# Altium project CNFET_PCB.PrjPcb (part 2 of 2)
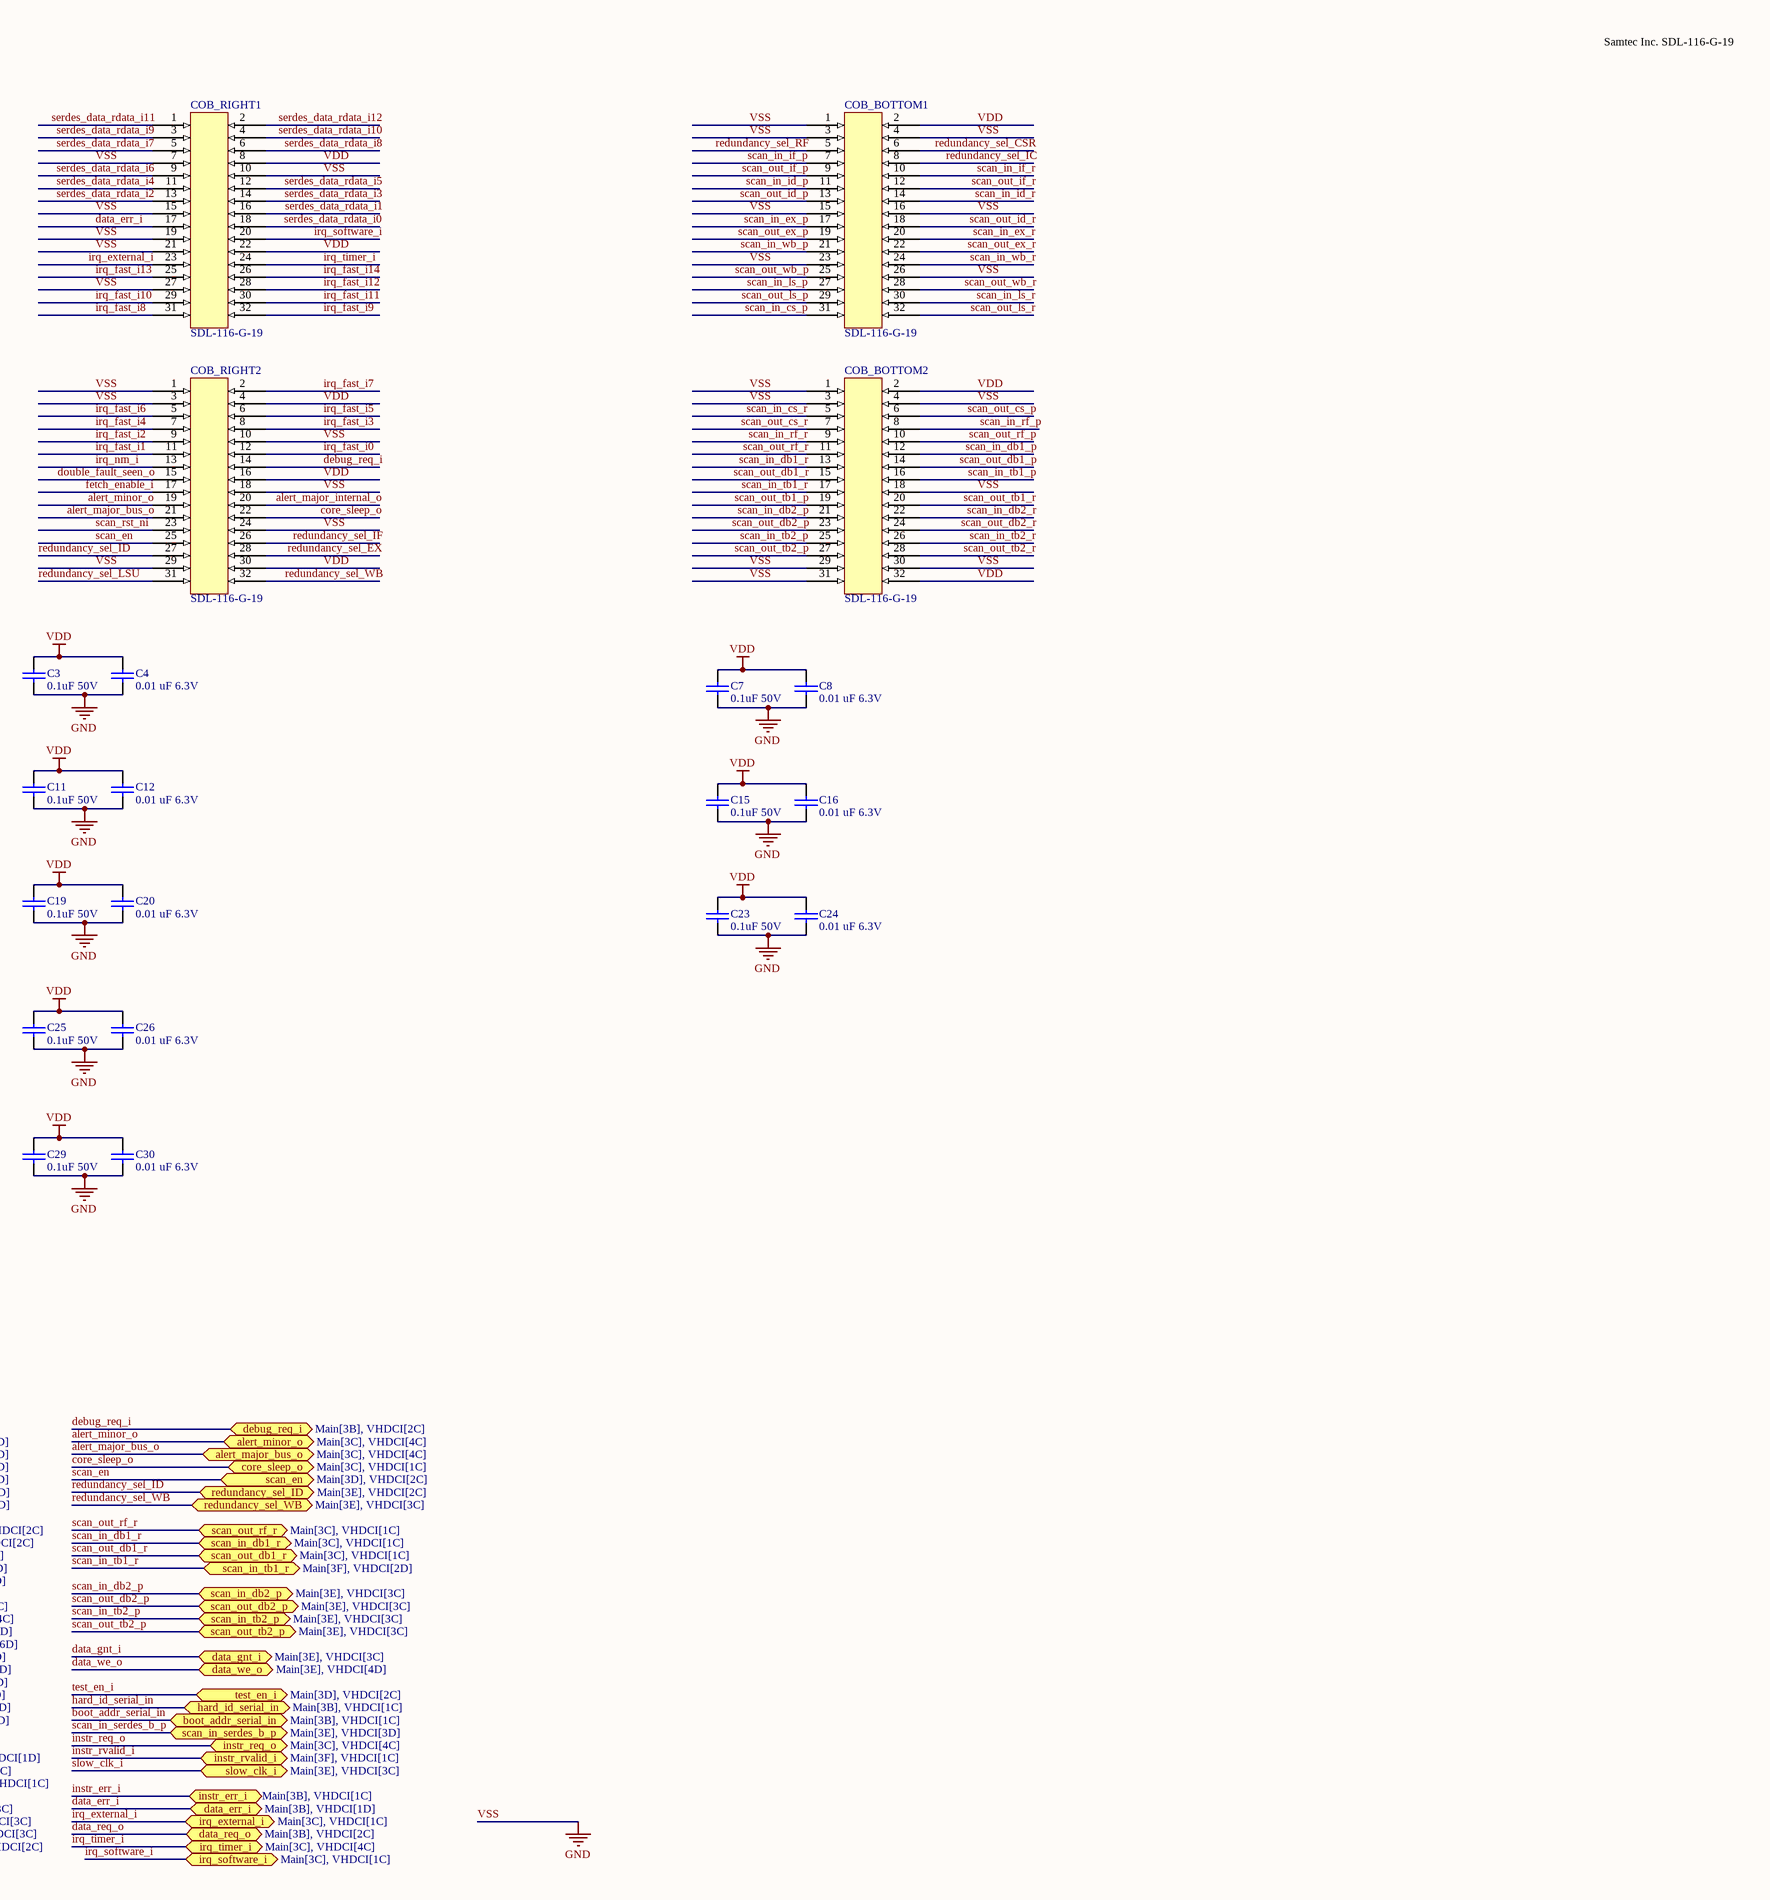
[diagram p5: COBConnector.SchDoc, right]

## Nets that join several sheets
VDD: VHDCI (J6.51), COBConnector (45 pins)
VSS: VHDCI (192 pins), COBConnector (81 pins)
alert_major_bus_o: VHDCI (J4.29), COBConnector (COB_RIGHT2.21)
alert_major_internal_o: VHDCI (J4.27), COBConnector (COB_RIGHT2.20)
alert_minor_o: VHDCI (J4.25), COBConnector (COB_RIGHT2.19)
boot_addr_serial_in: VHDCI (J6.27), COBConnector (COB_LEFT2.26)
boot_addr_shift_en: VHDCI (J6.25), COBConnector (COB_LEFT2.27)
core_sleep_o: VHDCI (J4.31), COBConnector (COB_RIGHT2.22)
data_err_i: VHDCI (J3.57), COBConnector (COB_RIGHT1.17)
data_gnt_i: VHDCI (J3.45), COBConnector (COB_TOP2.27)
data_req_o: VHDCI (J3.47), COBConnector (COB_TOP2.28)
data_rvalid_i: VHDCI (J3.43), COBConnector (COB_TOP2.26)
data_wdata_integ_o0: VHDCI (J3.7), COBConnector (COB_TOP1.8)
data_wdata_integ_o1: VHDCI (J3.5), COBConnector (COB_TOP1.7)
data_wdata_integ_o2: VHDCI (J3.3), COBConnector (COB_TOP1.10)
data_wdata_integ_o3: VHDCI (J3.1), COBConnector (COB_TOP1.9)
data_wdata_integ_o4: VHDCI (J3.35), COBConnector (COB_TOP1.12)
data_wdata_integ_o5: VHDCI (J3.37), COBConnector (COB_TOP1.11)
data_wdata_integ_o6: VHDCI (J3.39), COBConnector (COB_TOP1.16)
data_we_o: VHDCI (J3.41), COBConnector (COB_TOP2.25)
debug_req_i: VHDCI (J4.19), COBConnector (COB_RIGHT2.14)
double_fault_seen_o: VHDCI (J4.21), COBConnector (COB_RIGHT2.15)
fast_clk_i: VHDCI (J6.55), COBConnector (COB_LEFT2.2)
fetch_enable_i: VHDCI (J4.23), COBConnector (COB_RIGHT2.17)
hard_id_serial_in: VHDCI (J6.23), COBConnector (COB_LEFT2.28)
hard_id_shift_en: VHDCI (J6.21), COBConnector (COB_LEFT2.29)
instr_err_i: VHDCI (J3.49), COBConnector (COB_LEFT1.1)
instr_gnt_i: VHDCI (J6.59), COBConnector (COB_LEFT2.17)
instr_req_o: VHDCI (J6.61), COBConnector (COB_LEFT2.18)
instr_rvalid_i: VHDCI (J6.57), COBConnector (COB_LEFT2.16)
irq_external_i: VHDCI (J4.49), COBConnector (COB_RIGHT1.23)
irq_fast_i0: VHDCI (J4.15), COBConnector (COB_RIGHT2.12)
irq_fast_i1: VHDCI (J4.13), COBConnector (COB_RIGHT2.11)
irq_fast_i2: VHDCI (J4.11), COBConnector (COB_RIGHT2.9)
irq_fast_i3: VHDCI (J4.9), COBConnector (COB_RIGHT2.8)
irq_fast_i4: VHDCI (J4.7), COBConnector (COB_RIGHT2.7)
irq_fast_i5: VHDCI (J4.5), COBConnector (COB_RIGHT2.6)
irq_fast_i6: VHDCI (J4.3), COBConnector (COB_RIGHT2.5)
irq_fast_i7: VHDCI (J4.1), COBConnector (COB_RIGHT2.2)
irq_fast_i8: VHDCI (J4.35), COBConnector (COB_RIGHT1.31)
irq_fast_i9: VHDCI (J4.37), COBConnector (COB_RIGHT1.32)
irq_fast_i10: VHDCI (J4.39), COBConnector (COB_RIGHT1.29)
irq_fast_i11: VHDCI (J4.41), COBConnector (COB_RIGHT1.30)
irq_fast_i12: VHDCI (J4.43), COBConnector (COB_RIGHT1.28)
irq_fast_i13: VHDCI (J4.45), COBConnector (COB_RIGHT1.25)
irq_fast_i14: VHDCI (J4.47), COBConnector (COB_RIGHT1.26)
irq_nm_i: VHDCI (J4.17), COBConnector (COB_RIGHT2.13)
irq_software_i: VHDCI (J3.55), COBConnector (COB_RIGHT1.20)
irq_timer_i: VHDCI (J3.53), COBConnector (COB_RIGHT1.24)
redundancy_sel_CSR: VHDCI (J4.51), COBConnector (COB_BOTTOM1.6)
redundancy_sel_EX: VHDCI (J4.57), COBConnector (COB_RIGHT2.28)
redundancy_sel_IC: VHDCI (J5.47), COBConnector (COB_BOTTOM1.8)
redundancy_sel_ID: VHDCI (J4.59), COBConnector (COB_RIGHT2.27)
redundancy_sel_IF: VHDCI (J4.61), COBConnector (COB_RIGHT2.26)
redundancy_sel_LSU: VHDCI (J4.55), COBConnector (COB_RIGHT2.31)
redundancy_sel_RF: VHDCI (J5.49), COBConnector (COB_BOTTOM1.5)
redundancy_sel_WB: VHDCI (J4.53), COBConnector (COB_RIGHT2.32)
rst_ni: VHDCI (J6.17), COBConnector (COB_LEFT2.31)
scan_en: VHDCI (J4.63), COBConnector (COB_RIGHT2.25)
scan_in_cs_p: VHDCI (J5.29), COBConnector (COB_BOTTOM1.31)
scan_in_cs_r: VHDCI (J5.31), COBConnector (COB_BOTTOM2.5)
scan_in_db1_p: VHDCI (J5.53), COBConnector (COB_BOTTOM2.12)
scan_in_db1_r: VHDCI (J5.51), COBConnector (COB_BOTTOM2.13)
scan_in_db2_p: VHDCI (J6.1), COBConnector (COB_BOTTOM2.21)
scan_in_db2_r: VHDCI (J6.3), COBConnector (COB_BOTTOM2.22)
scan_in_ex_p: VHDCI (J5.5), COBConnector (COB_BOTTOM1.17)
scan_in_ex_r: VHDCI (J5.7), COBConnector (COB_BOTTOM1.20)
scan_in_id_p: VHDCI (J5.37), COBConnector (COB_BOTTOM1.11)
scan_in_id_r: VHDCI (J5.35), COBConnector (COB_BOTTOM1.14)
scan_in_if_p: VHDCI (J5.45), COBConnector (COB_BOTTOM1.7)
scan_in_if_r: VHDCI (J5.43), COBConnector (COB_BOTTOM1.10)
scan_in_ls_p: VHDCI (J5.21), COBConnector (COB_BOTTOM1.27)
scan_in_ls_r: VHDCI (J5.23), COBConnector (COB_BOTTOM1.30)
scan_in_rf_p: VHDCI (J5.61), COBConnector (COB_BOTTOM2.8)
scan_in_rf_r: VHDCI (J5.59), COBConnector (COB_BOTTOM2.9)
scan_in_serdes_a_p: VHDCI (J6.29), COBConnector (COB_LEFT2.25)
scan_in_serdes_b_p: VHDCI (J6.65), COBConnector (COB_LEFT2.20)
scan_in_tb1_p: VHDCI (J6.41), COBConnector (COB_BOTTOM2.16)
scan_in_tb1_r: VHDCI (J6.39), COBConnector (COB_BOTTOM2.17)
scan_in_tb2_p: VHDCI (J6.9), COBConnector (COB_BOTTOM2.25)
scan_in_tb2_r: VHDCI (J6.11), COBConnector (COB_BOTTOM2.26)
scan_in_wb_p: VHDCI (J5.13), COBConnector (COB_BOTTOM1.21)
scan_in_wb_r: VHDCI (J5.15), COBConnector (COB_BOTTOM1.24)
scan_out_cs_p: VHDCI (J5.65), COBConnector (COB_BOTTOM2.6)
scan_out_cs_r: VHDCI (J5.63), COBConnector (COB_BOTTOM2.7)
scan_out_db1_p: VHDCI (J6.45), COBConnector (COB_BOTTOM2.14)
scan_out_db1_r: VHDCI (J6.43), COBConnector (COB_BOTTOM2.15)
scan_out_db2_p: VHDCI (J6.5), COBConnector (COB_BOTTOM2.23)
scan_out_db2_r: VHDCI (J6.7), COBConnector (COB_BOTTOM2.24)
scan_out_ex_p: VHDCI (J5.9), COBConnector (COB_BOTTOM1.19)
scan_out_ex_r: VHDCI (J5.11), COBConnector (COB_BOTTOM1.22)
scan_out_id_p: VHDCI (J5.1), COBConnector (COB_BOTTOM1.13)
scan_out_id_r: VHDCI (J5.3), COBConnector (COB_BOTTOM1.18)
scan_out_if_p: VHDCI (J5.41), COBConnector (COB_BOTTOM1.9)
scan_out_if_r: VHDCI (J5.39), COBConnector (COB_BOTTOM1.12)
scan_out_ls_p: VHDCI (J5.25), COBConnector (COB_BOTTOM1.29)
scan_out_ls_r: VHDCI (J5.27), COBConnector (COB_BOTTOM1.32)
scan_out_rf_p: VHDCI (J5.57), COBConnector (COB_BOTTOM2.10)
scan_out_rf_r: VHDCI (J5.55), COBConnector (COB_BOTTOM2.11)
scan_out_serdes_a_p: VHDCI (J6.31), COBConnector (COB_LEFT2.23)
scan_out_serdes_b_p: VHDCI (J6.63), COBConnector (COB_LEFT2.19)
scan_out_tb1_p: VHDCI (J6.37), COBConnector (COB_BOTTOM2.19)
scan_out_tb1_r: VHDCI (J6.35), COBConnector (COB_BOTTOM2.20)
scan_out_tb2_p: VHDCI (J6.13), COBConnector (COB_BOTTOM2.27)
scan_out_tb2_r: VHDCI (J6.15), COBConnector (COB_BOTTOM2.28)
scan_out_wb_p: VHDCI (J5.17), COBConnector (COB_BOTTOM1.25)
scan_out_wb_r: VHDCI (J5.19), COBConnector (COB_BOTTOM1.28)
scan_rst_ni: VHDCI (J4.65), COBConnector (COB_RIGHT2.23)
serdes_data_addr_o0: VHDCI (J2.15), COBConnector (COB_TOP2.6)
serdes_data_addr_o1: VHDCI (J2.13), COBConnector (COB_TOP2.7)
serdes_data_addr_o2: VHDCI (J2.11), COBConnector (COB_TOP2.8)
serdes_data_addr_o3: VHDCI (J2.9), COBConnector (COB_TOP2.9)
serdes_data_addr_o4: VHDCI (J2.7), COBConnector (COB_TOP2.10)
serdes_data_addr_o5: VHDCI (J2.5), COBConnector (COB_TOP2.11)
serdes_data_addr_o6: VHDCI (J2.3), COBConnector (COB_TOP2.12)
serdes_data_addr_o7: VHDCI (J2.1), COBConnector (COB_TOP2.13)
serdes_data_addr_o8: VHDCI (J2.35), COBConnector (COB_TOP2.14)
serdes_data_addr_o9: VHDCI (J2.37), COBConnector (COB_TOP2.15)
serdes_data_addr_o10: VHDCI (J2.39), COBConnector (COB_TOP2.16)
serdes_data_addr_o11: VHDCI (J2.41), COBConnector (COB_TOP2.18)
serdes_data_addr_o12: VHDCI (J2.43), COBConnector (COB_TOP2.19)
serdes_data_addr_o13: VHDCI (J2.45), COBConnector (COB_TOP2.20)
serdes_data_addr_o14: VHDCI (J2.47), COBConnector (COB_TOP2.21)
serdes_data_addr_o15: VHDCI (J2.49), COBConnector (COB_TOP2.22)
serdes_data_be_o0: VHDCI (J6.47), COBConnector (COB_TOP2.23)
serdes_data_be_o1: VHDCI (J6.49), COBConnector (COB_TOP2.24)
serdes_data_rdata_i0: VHDCI (J3.59), COBConnector (COB_RIGHT1.18)
serdes_data_rdata_i1: VHDCI (J3.61), COBConnector (COB_RIGHT1.16)
serdes_data_rdata_i2: VHDCI (J3.63), COBConnector (COB_RIGHT1.13)
serdes_data_rdata_i3: VHDCI (J3.65), COBConnector (COB_RIGHT1.14)
serdes_data_rdata_i4: VHDCI (J3.31), COBConnector (COB_RIGHT1.11)
serdes_data_rdata_i5: VHDCI (J3.29), COBConnector (COB_RIGHT1.12)
serdes_data_rdata_i6: VHDCI (J3.27), COBConnector (COB_RIGHT1.9)
serdes_data_rdata_i7: VHDCI (J3.25), COBConnector (COB_RIGHT1.5)
serdes_data_rdata_i8: VHDCI (J3.23), COBConnector (COB_RIGHT1.6)
serdes_data_rdata_i9: VHDCI (J3.21), COBConnector (COB_RIGHT1.3)
serdes_data_rdata_i10: VHDCI (J3.19), COBConnector (COB_RIGHT1.4)
serdes_data_rdata_i11: VHDCI (J3.17), COBConnector (COB_RIGHT1.1)
serdes_data_rdata_i12: VHDCI (J3.15), COBConnector (COB_RIGHT1.2)
serdes_data_rdata_i13: VHDCI (J3.13), COBConnector (COB_TOP1.3)
serdes_data_rdata_i14: VHDCI (J3.11), COBConnector (COB_TOP1.6)
serdes_data_rdata_i15: VHDCI (J3.9), COBConnector (COB_TOP1.5)
serdes_data_wdata_o0: VHDCI (J2.51), COBConnector (COB_TOP1.15)
serdes_data_wdata_o1: VHDCI (J2.53), COBConnector (COB_TOP1.18)
serdes_data_wdata_o2: VHDCI (J2.55), COBConnector (COB_TOP1.17)
serdes_data_wdata_o3: VHDCI (J2.57), COBConnector (COB_TOP1.20)
serdes_data_wdata_o4: VHDCI (J2.59), COBConnector (COB_TOP1.19)
serdes_data_wdata_o5: VHDCI (J2.61), COBConnector (COB_TOP1.22)
serdes_data_wdata_o6: VHDCI (J2.63), COBConnector (COB_TOP1.21)
serdes_data_wdata_o7: VHDCI (J2.65), COBConnector (COB_TOP1.26)
serdes_data_wdata_o8: VHDCI (J2.31), COBConnector (COB_TOP1.25)
serdes_data_wdata_o9: VHDCI (J2.29), COBConnector (COB_TOP1.28)
serdes_data_wdata_o10: VHDCI (J2.27), COBConnector (COB_TOP1.27)
serdes_data_wdata_o11: VHDCI (J2.25), COBConnector (COB_TOP1.30)
serdes_data_wdata_o12: VHDCI (J2.23), COBConnector (COB_TOP1.29)
serdes_data_wdata_o13: VHDCI (J2.21), COBConnector (COB_TOP1.32)
serdes_data_wdata_o14: VHDCI (J2.19), COBConnector (COB_TOP1.31)
serdes_data_wdata_o15: VHDCI (J2.17), COBConnector (COB_TOP2.5)
serdes_instr_addr_o0: VHDCI (J1.39), COBConnector (COB_LEFT1.26)
serdes_instr_addr_o1: VHDCI (J1.41), COBConnector (COB_LEFT1.25)
serdes_instr_addr_o2: VHDCI (J1.43), COBConnector (COB_LEFT1.27)
serdes_instr_addr_o3: VHDCI (J1.45), COBConnector (COB_LEFT1.30)
serdes_instr_addr_o4: VHDCI (J1.47), COBConnector (COB_LEFT1.29)
serdes_instr_addr_o5: VHDCI (J1.49), COBConnector (COB_LEFT1.32)
serdes_instr_addr_o6: VHDCI (J1.51), COBConnector (COB_LEFT2.1)
serdes_instr_addr_o7: VHDCI (J1.53), COBConnector (COB_LEFT2.5)
serdes_instr_addr_o8: VHDCI (J1.55), COBConnector (COB_LEFT2.7)
serdes_instr_addr_o9: VHDCI (J1.57), COBConnector (COB_LEFT2.8)
serdes_instr_addr_o10: VHDCI (J1.59), COBConnector (COB_LEFT2.9)
serdes_instr_addr_o11: VHDCI (J1.61), COBConnector (COB_LEFT2.10)
serdes_instr_addr_o12: VHDCI (J1.63), COBConnector (COB_LEFT2.11)
serdes_instr_addr_o13: VHDCI (J1.65), COBConnector (COB_LEFT2.12)
serdes_instr_addr_o14: VHDCI (J1.31), COBConnector (COB_LEFT2.13)
serdes_instr_addr_o15: VHDCI (J1.29), COBConnector (COB_LEFT2.15)
serdes_instr_rdata_i0: VHDCI (J1.27), COBConnector (COB_LEFT1.5)
serdes_instr_rdata_i1: VHDCI (J1.25), COBConnector (COB_LEFT1.8)
serdes_instr_rdata_i2: VHDCI (J1.23), COBConnector (COB_LEFT1.7)
serdes_instr_rdata_i3: VHDCI (J1.21), COBConnector (COB_LEFT1.10)
serdes_instr_rdata_i4: VHDCI (J1.19), COBConnector (COB_LEFT1.9)
serdes_instr_rdata_i5: VHDCI (J1.17), COBConnector (COB_LEFT1.12)
serdes_instr_rdata_i6: VHDCI (J1.15), COBConnector (COB_LEFT1.11)
serdes_instr_rdata_i7: VHDCI (J1.13), COBConnector (COB_LEFT1.14)
serdes_instr_rdata_i8: VHDCI (J1.11), COBConnector (COB_LEFT1.13)
serdes_instr_rdata_i9: VHDCI (J1.9), COBConnector (COB_LEFT1.16)
serdes_instr_rdata_i10: VHDCI (J1.7), COBConnector (COB_LEFT1.15)
serdes_instr_rdata_i11: VHDCI (J1.5), COBConnector (COB_LEFT1.19)
serdes_instr_rdata_i12: VHDCI (J1.3), COBConnector (COB_LEFT1.22)
serdes_instr_rdata_i13: VHDCI (J1.1), COBConnector (COB_LEFT1.21)
serdes_instr_rdata_i14: VHDCI (J1.35), COBConnector (COB_LEFT1.24)
serdes_instr_rdata_i15: VHDCI (J1.37), COBConnector (COB_LEFT1.23)
slow_clk_i: VHDCI (J6.53), COBConnector (COB_LEFT1.31)
test_en_i: VHDCI (J6.19), COBConnector (COB_LEFT2.30)